# Altium schematic sheet Transformer.SchDoc: Transformer
size Letter; Date: 2017-01-26; DocumentNumber: 5; Revision: A; SheetNumber: 5; SheetTotal: 16; DesignedBy: Mike MacKay
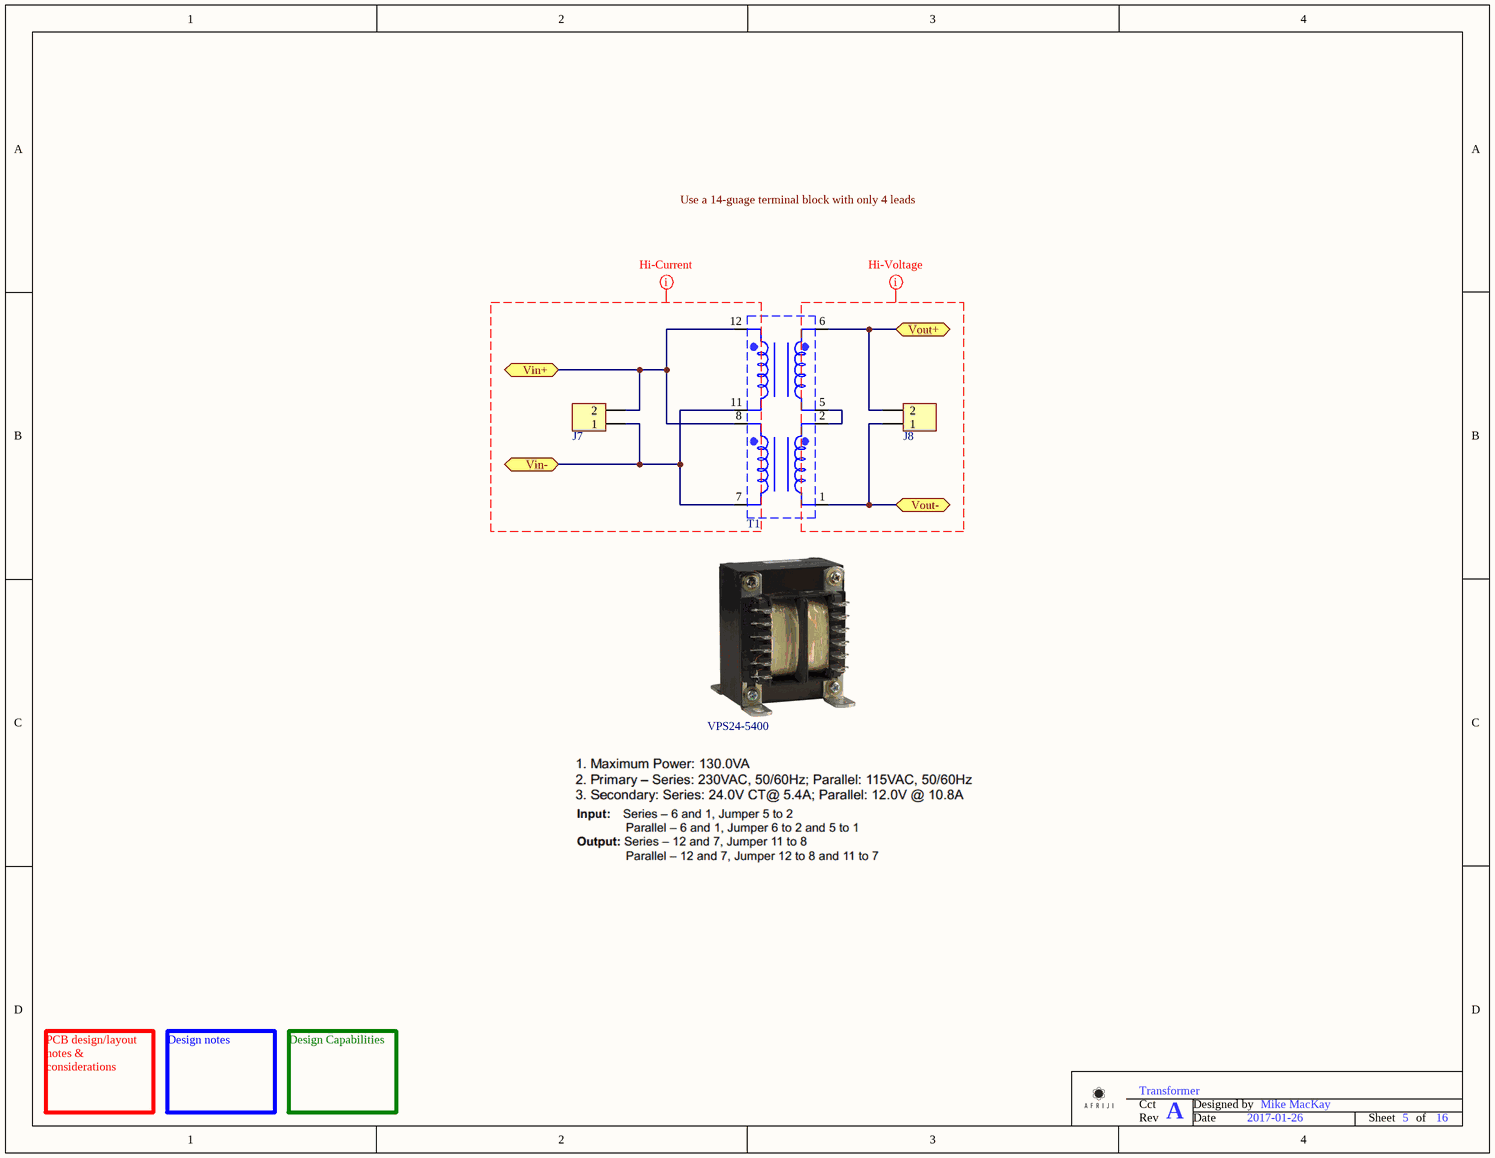
[diagram p0: Transformer.SchDoc]

## Parts
J7  Terminal Block - 2-Position HiV/HiA  [TE 796739-2]  (value not drawn)
J8  Terminal Block - 2-Position HiV/HiA  [TE 796739-2]  (value not drawn)
T1  Transformer Connector  (value not drawn)  (graphical)
Transformer1  Manufacturer Part Number: VPS24-5400  [Transformer]  (hidden comment: Transformer)

## Ports
Vin+ (bidir), Vin- (bidir), Vout+ (bidir), Vout- (bidir)

## Nets
Vin+: J7.2 T1.8 T1.12 ; port Vin+
Vin-: J7.1 T1.7 T1.11 ; port Vin-
Vout+: J8.2 T1.6 ; port Vout+
Vout-: J8.1 T1.1 ; port Vout-
NetT1_2: T1.2 T1.5

## Layout directives
net class 171-250V: (no net found under the mark)
net class 15A: (no net found under the mark)

## Notes on the sheet
- PCB design/layout notes & considerations
- Design notes
- Design Capabilities
- Cct
- Designed by
- Rev
- Date
- Sheet
- of
- Labels drawn without touching a wire or pin: Use a 14-guage terminal block with only 4 leads

## Library data of the parts
J7 J8 = Terminal Block - 2-Position HiV/HiA: Manufacturer: TE Connectivity AMP Connectors; Manufacturer Part Number: 796739-2; Number of Levels: 1; Positions Per Level: 2; Pitch: 0.375" (9.53mm); Mating Orientation: Horizontal with Board; Current: 30A; Voltage: 600V; Wire Gauge: 10-30 AWG; Wire Termination: Screw - Rising Cage Clamp; Clamp Material - Plating: Brass - Nickel Plated; Torque - Screw: 0.79 Nm (7.0 Lb-In); Screw Thread: M3; Supplier 1: Digi-Key; RoHS: RoHS Compliant; Category: Connectors, Interconnects; Stock 1: 14124; Pricing 1: 1=2.21, 10=1.673, 25=1.5504, 50=1.394, 100=1.36, 250=1.19, 500=1.088, 1000=0.986, 2500=0.884 (USD); Packaging: Tray; Part Status: Active; Mounting Type: Through Hole; Features: Interlocking (Side); Color: Green; Operating Temperature: -; Housing Material: Polyamide (PA66), Nylon 6/6; Contact Material - Plating: -; Screw Material - Plating: Brass - Nickel Plated; ComponentLink1URL: http://www.te.com/commerce/DocumentDelivery/DDEController?Action=srchrtrv&DocNm=796739&DocType=Customer+Drawing&DocLang=English; ComponentLink1Description: Spec Sheet; Supplier Part Number 1: A98273-ND
Transformer1 = Transformer: Manufacturer: Triad Magnetics; Voltage - Primary: 115V, 230V; Voltage - Secondary (Full Load): Parallel 12V, Series 24V; Current - Output (Max): Parallel 10.8A, Series 5.4A; Primary Winding(s): Dual; Center Tap: No; Power - Max: 130 VA; Voltage - Isolation: 4000Vrms; Supplier 1: Digi-Key; RoHS: RoHS Compliant; Category: Transformers; Stock 1: 223; Pricing 1: 1=27.01, 10=23.831, 25=23.0364, 50=20.6534, 100=19.8591 (USD); Part Status: Active; Type: Laminated Core; Secondary Winding(s): Dual; Mounting Type: Chassis Mount; Termination Style: Solder, Quick Connect; Size / Dimension: 60.45mm L x 68.33mm W; Height - Seated (Max): 85.85mm; ComponentLink1URL: http://catalog.triadmagnetics.com/Asset/VPS24-5400.pdf; ComponentLink1Description: Spec Sheet; Supplier Part Number 1: 237-1277-ND